# Altium schematic sheet mipi_deserializer.SchDoc (part 2 of 2)
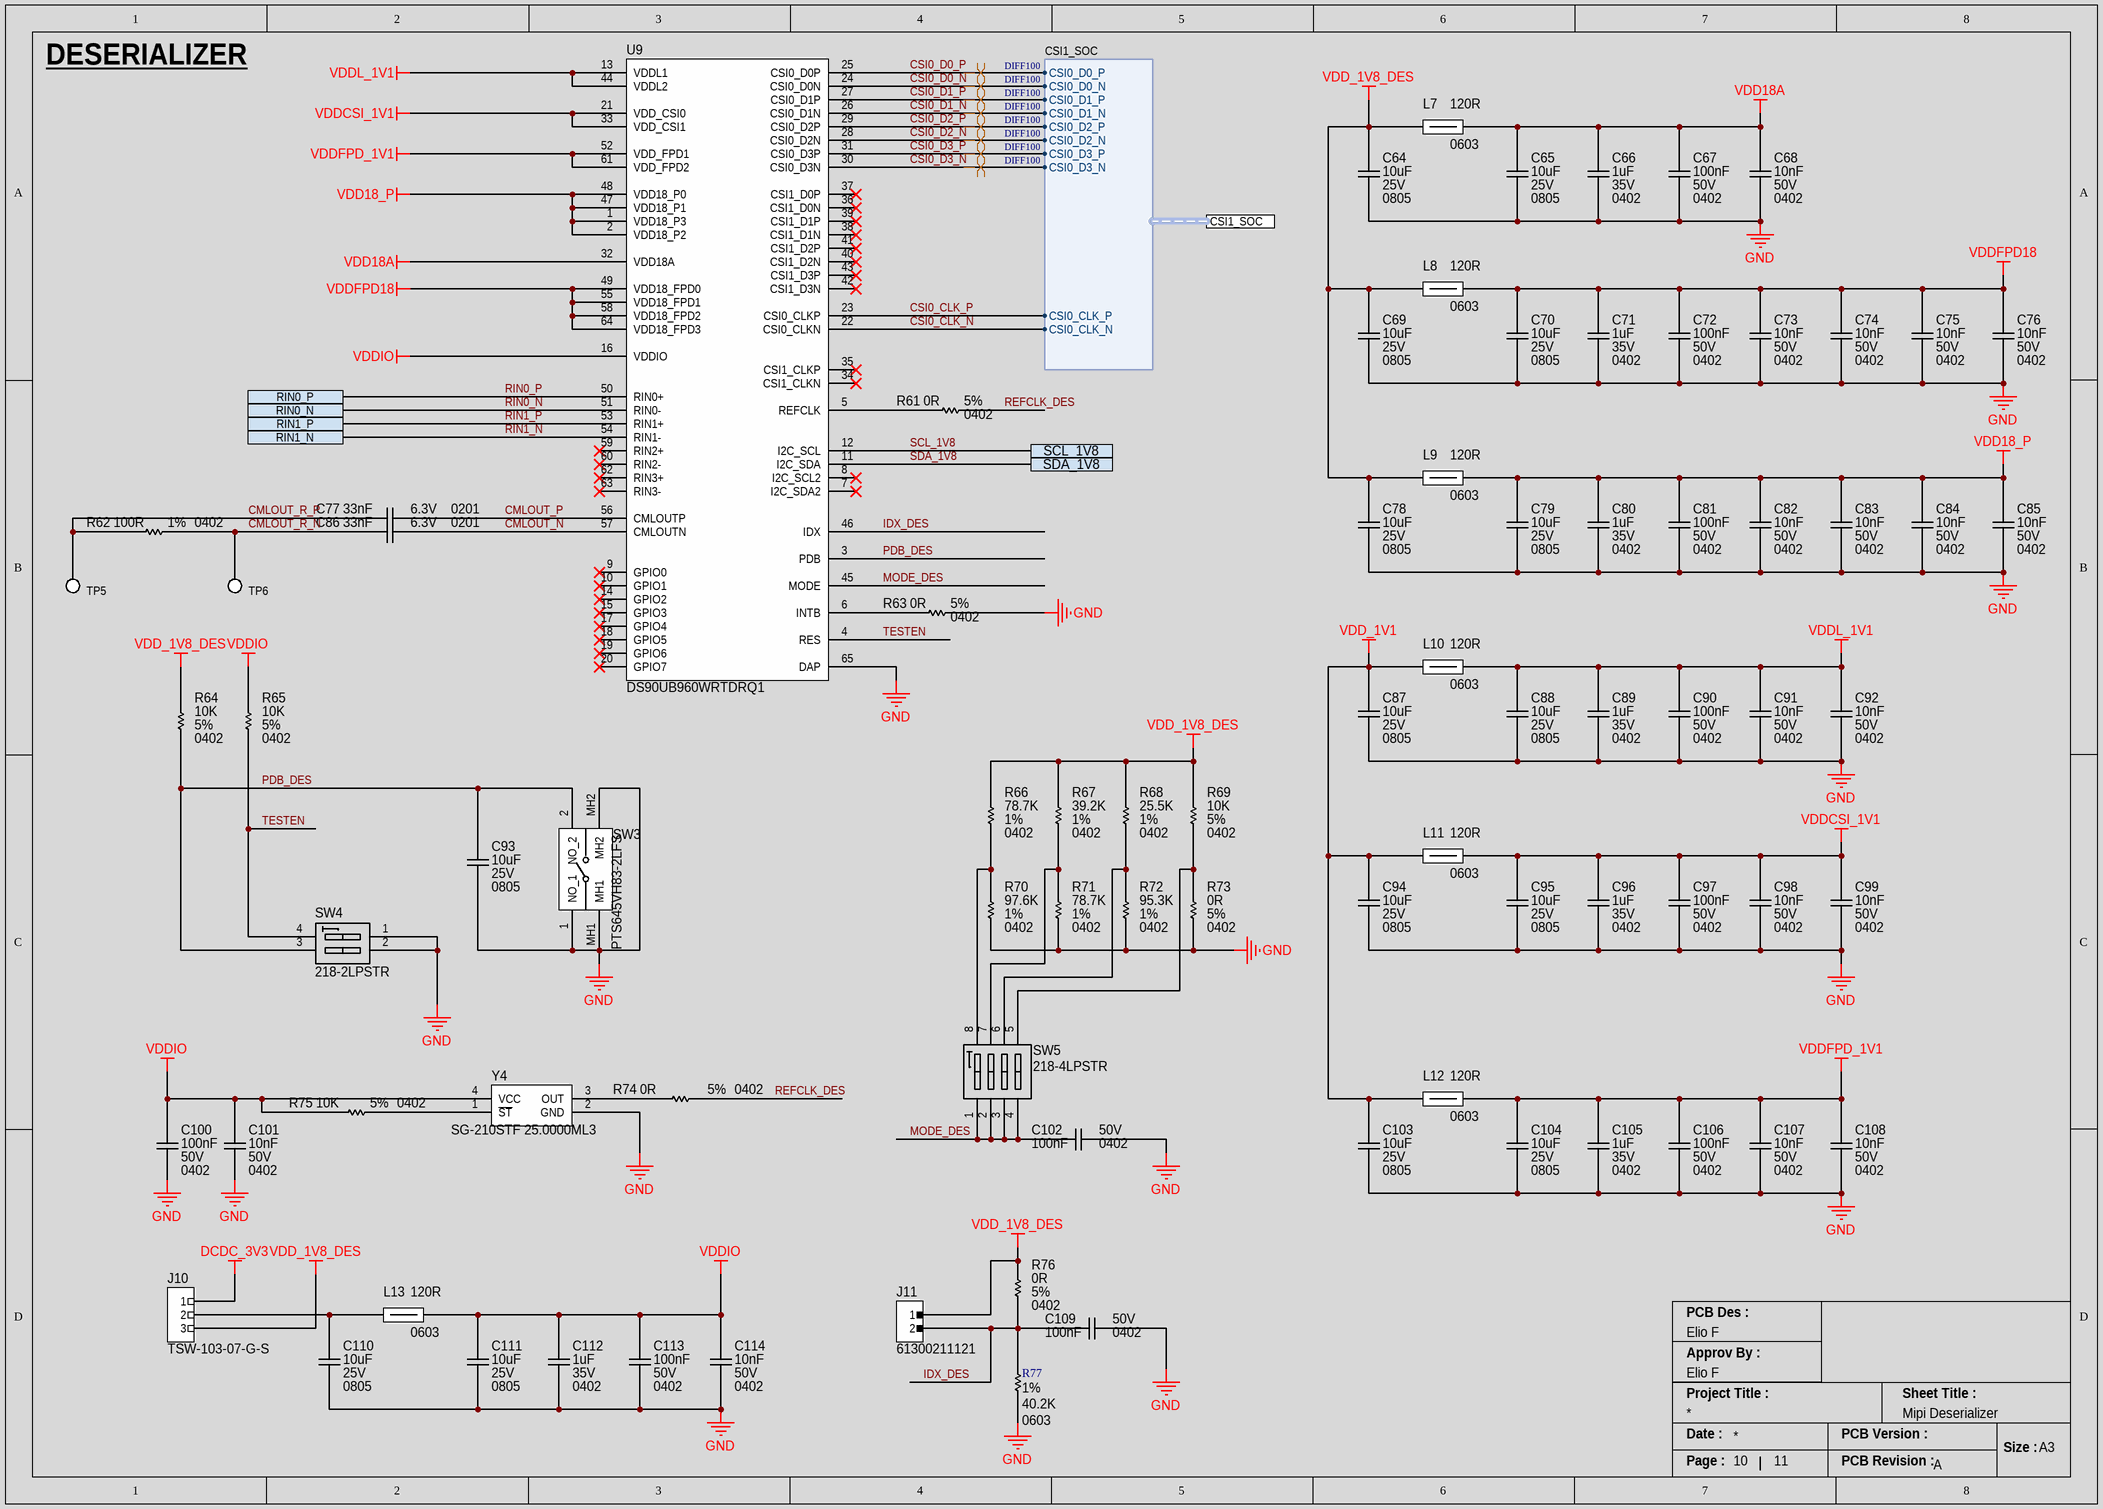
[diagram p1: mipi_deserializer.SchDoc]

## Library data of the parts
C64 C65 C69 C70 C78 C79 C87 C88 C93-C95 C103 C104 C110 C111 = CAP_10UF_25V_X5R_0805: CAP CER 10UF 25V X5R 0805; Manufacturer: Samsung; Tolerance: 10%; Manufacturer Part Number: CL21A106KAYNNNE; RoHS: Yes; Category: Ceramic Capacitors; Stock 1: 1531231; Pricing 1: 1=0.18000, 10=0.12800, 50=0.07280, 100=0.06030, 500=0.04230, 1000=0.03501 (USD); Mount: Surface Mount; Case Code (Metric): 2012; Case Code (Imperial): 0805; Min Operating Temperature: -55°C; Max Operating Temperature: 85°C; Package Quantity: 1; Packaging: Tape and Reel; Dielectric: X5R; Series: CL; Construction: Flat; Length: 2mm; Width: 0.049inch; Height: 1.25mm; Depth: 1.25mm; Thickness: 0.057inch; Radiation Hardening: No; RoHS Compliant: Yes; ComponentLink1URL: https://datasheet.ciiva.com/25796/cl21a106kaynnne-25796720.pdf?src-supplier=Digi-Key; ComponentLink1Description: https://datasheet.ciiva.com/25796/cl21a106kaynnne-25796720.pdf?src-supplier=Digi-Key; ComponentLink2URL: https://datasheet.ciiva.com/26838/getdatasheetpartid-357558-26838583.pdf?src-supplier=Verical; ComponentLink2Description: https://datasheet.ciiva.com/26838/getdatasheetpartid-357558-26838583.pdf?src-supplier=Verical; Supplier 1: Digi-Key; Supplier 2: Newark; Supplier 3: Mouser; Supplier Part Number 1: 1276-2891-6-ND; Supplier Part Number 2: 82AC9388; Supplier Part Number 3: 187-CL21A106KAYNNNE
C66 C71 C80 C89 C96 C105 C112 = CAP_1uF_35V_JB_0402: Cap Ceramic 1uF 35V JB 10% SMD 0402 85°C Punched Paper T/R; Manufacturer: TDK; Material: 4241ConductorMaterial; Supplier 1: Digikey; Manufacturer Part Number: C1005JB1V105K050BC; RoHS: Yes; Category: Ceramic Capacitors; Stock 1: 17379; Pricing 1: 1=0.17, 10=0.095, 50=0.0662, 100=0.0574, 500=0.04248, 1000=0.03785, 2500=0.03294, 5000=0.02996 (USD); Mount: Surface Mount; Case Code (Metric): 1005; Case Code (Imperial): 0402; Weight: 0.001199oz; Dielectric Material: Ceramic; Min Operating Temperature: -25°C; Max Operating Temperature: 85°C; Package Quantity: 10000; Packaging: Tape and Reel; Tolerance: 10%; Termination: SMD/SMT; Voltage Rating (DC): 35V; Series: C; Length: 0.039inch; Width: 0.02inch; Height: 550um; Thickness: 0.022inch; Lead Free: Lead Free; RoHS Compliant: Yes; ComponentLink1URL: https://datasheet.ciiva.com/14885/tdkmlcccaprange-14885800.pdf?src-supplier=Digikey; ComponentLink1Description: https://datasheet.ciiva.com/14885/tdkmlcccaprange-14885800.pdf?src-supplier=Digikey; ComponentLink2URL: https://datasheet.ciiva.com/14885/tdkmlcccaprange-14885801.pdf?src-supplier=Digikey; ComponentLink2Description: https://datasheet.ciiva.com/14885/tdkmlcccaprange-14885801.pdf?src-supplier=Digikey; ComponentLink3URL: https://datasheet.ciiva.com/14885/tdkmlcccaprange-14885802.pdf?src-supplier=Digikey; ComponentLink3Description: https://datasheet.ciiva.com/14885/tdkmlcccaprange-14885802.pdf?src-supplier=Digikey; Supplier Part Number 1: 445-11014-1-ND
C67 C72 C81 C90 C97 C100 C102 C106 C109 C113 = CAP_100NF_50V_X7R_0402: Multilayer Ceramic Capacitor, 0.1 uF, 16 V, ± 10%, X7R, 0402 [1005 Metric]; Manufacturer: Murata; Dissipation Factor: 0.025%; Temperature Coefficient: 30ppm/°C; Supplier 1: DigiKey; Manufacturer Part Number: GRM155R71H104KE14D; RoHS: Yes; Category: Ceramic Capacitors; Stock 1: 13730790; Pricing 1: 1=0.1, 10=0.023, 50=0.0132, 100=0.0102, 500=0.00768, 1000=0.00603, 2500=0.00548, 5000=0.00504 (USD); Mount: Surface Mount; Number of Pins: 2NUMBER; Case Code (Metric): 1005; Material: Ceramic; Case Code (Imperial): 0402; Weight: 0.000212oz; Dielectric Material: Ceramic; Min Operating Temperature: -55°C; Max Operating Temperature: 125°C; Packaging: Tape and Reel; Package Quantity: 10000; Series: GRM; Tolerance: 10%; Dielectric: X7R; Termination: SMD/SMT; Voltage: 50V; Voltage Rating (DC): 50V; Construction: Flat; Length: 1mm; Width: 0.5mm; Height: 0.5mm; Depth: 0.5mm; Thickness: 0.022inch; Reach SVHC Compliant: No; RoHS Compliant: Yes; Lead Free: 5697LeadFree; ComponentLink1URL: http://www.farnell.com/datasheets/2079156.pdf?src-supplier=Farnell; ComponentLink1Description: http://www.farnell.com/datasheets/2079156.pdf?src-supplier=Farnell; ComponentLink2URL: http://www.mouser.com/ds/2/281/c02e-2905.pdf?src-supplier=Mouser; ComponentLink2Description: http://www.mouser.com/ds/2/281/c02e-2905.pdf?src-supplier=Mouser; ComponentLink3URL: http://www.farnell.com/datasheets/2079156.pdf?src-supplier=Newark; ComponentLink3Description: http://www.farnell.com/datasheets/2079156.pdf?src-supplier=Newark; ComponentLink4URL: https://datasheet.octopart.com/GRM155R71H104KE14D-Murata-datasheet-22122223.pdf?src-supplier=Future+Electronics; ComponentLink4Description: https://datasheet.octopart.com/GRM155R71H104KE14D-Murata-datasheet-22122223.pdf?src-supplier=Future+Electronics; ComponentLink5URL: https://search.murata.co.jp/Ceramy/image/img/A01X/G101/ENG/GRM155R71H104KE14-01.pdf?src-supplier=Digi-Key; ComponentLink5Description: https://search.murata.co.jp/Ceramy/image/img/A01X/G101/ENG/GRM155R71H104KE14-01.pdf?src-supplier=Digi-Key; ComponentLink6URL: http://psearch.en.murata.com/capacitor/product/GRM155R71H104KE14%23.pdf?src-supplier=Avnet; ComponentLink6Description: http://psearch.en.murata.com/capacitor/product/GRM155R71H104KE14%23.pdf?src-supplier=Avnet; ComponentLink7URL: https://datasheet.octopart.com/GRM155R71H104KE14D-Murata-datasheet-66077078.pdf?src-supplier=Element14; ComponentLink7Description: https://datasheet.octopart.com/GRM155R71H104KE14D-Murata-datasheet-66077078.pdf?src-supplier=Element14; Supplier Part Number 1: 490-10700-6-ND; Supplier 2: Digikey; Stock 2: 3706055; Pricing 2: 1=0.1, 10=0.037, 50=0.021, 100=0.0162, 500=0.01224, 1000=0.00961, 2500=0.00874, 5000=0.00804 (USD); Halogen Free: 5694HalogenFree; ComponentLink8URL: http://www.mouser.com/ds/2/447/UPY-GPHC_X5R_4V-to-50V_25-1131599.pdf?src-supplier=Mouser; ComponentLink8Description: http://www.mouser.com/ds/2/447/UPY-GPHC_X5R_4V-to-50V_25-1131599.pdf?src-supplier=Mouser; ComponentLink9URL: https://datasheet.octopart.com/CC0402KRX5R8BB104-Yageo-datasheet-137700082.pdf?src-supplier=Future+Electronics; ComponentLink9Description: https://datasheet.octopart.com/CC0402KRX5R8BB104-Yageo-datasheet-137700082.pdf?src-supplier=Future+Electronics; ComponentLink10URL: http://www.yageo.com/documents/recent/UPY-GPHC_X5R_4V-to-50V_25.pdf?src-supplier=Digikey; ComponentLink10Description: http://www.yageo.com/documents/recent/UPY-GPHC_X5R_4V-to-50V_25.pdf?src-supplier=Digikey; ComponentLink11URL: https://datasheet.octopart.com/CC0402KRX5R8BB104-Yageo-datasheet-140260304.pdf?src-supplier=Newark; ComponentLink11Description: https://datasheet.octopart.com/CC0402KRX5R8BB104-Yageo-datasheet-140260304.pdf?src-supplier=Newark; ComponentLink12URL: https://datasheet.octopart.com/CC0402KRX5R8BB104-Yageo-datasheet-170350636.pdf?src-supplier=Future+Electronics; ComponentLink12Description: https://datasheet.octopart.com/CC0402KRX5R8BB104-Yageo-datasheet-170350636.pdf?src-supplier=Future+Electronics; ComponentLink13URL: http://www.yageo.com/documents/recent/UPY-GPHC_X5R_4V-to-50V-16.pdf?src-supplier=Future+Electronics; ComponentLink13Description: http://www.yageo.com/documents/recent/UPY-GPHC_X5R_4V-to-50V-16.pdf?src-supplier=Future+Electronics; Supplier Part Number 2: 311-1697-1-ND
C68 C73-C76 C82-C85 C91 C92 C98 C99 C101 C107 C108 C114 = CAP_10nF_50V_X7R_0402: Multilayer Ceramic Capacitors MLCC Surface Mount 0402 0.01uF 50 Volts X7R 10%; Manufacturer: Murata; Voltage: 25V; Supplier 1: Digikey; Manufacturer Part Number: GRM155R71H103KA88D; RoHS: Yes; Category: Ceramic Capacitors; Stock 1: 5190059; Pricing 1: 1=0.1, 10=0.023, 50=0.013, 100=0.0101, 500=0.0076, 1000=0.00598, 2500=0.00543, 5000=0.005 (USD); Mount: Surface Mount; Number of Pins: 2; Case Code (Metric): 1005; Case Code (Imperial): 0402; Material: Ceramic; Min Operating Temperature: -55°C; Max Operating Temperature: 125°C; Tolerance: 10%; Packaging: Tape and Reel; Package Quantity: 1; Dielectric: X7R; Termination: SMD/SMT; Series: GRM; Construction: Flat; Voltage Rating (DC): 50V; Length: 1mm; Width: 0.02inch; Height: 0.5mm; Thickness: 0.022inch; Depth: 0.5mm; Radiation Hardening: No; Reach SVHC Compliant: No; RoHS Compliant: Yes; Lead Free: 5697LeadFree; ComponentLink1URL: https://datasheet.ciiva.com/22698/1747449-22698420.pdf?src-supplier=Element14; ComponentLink1Description: https://datasheet.ciiva.com/22698/1747449-22698420.pdf?src-supplier=Element14; ComponentLink2URL: https://datasheet.ciiva.com/19476/1856433-19476546.pdf?src-supplier=Jameco; ComponentLink2Description: https://datasheet.ciiva.com/19476/1856433-19476546.pdf?src-supplier=Jameco; ComponentLink3URL: https://datasheet.ciiva.com/129/product-129810.pdf?src-supplier=Digikey; ComponentLink3Description: https://datasheet.ciiva.com/129/product-129810.pdf?src-supplier=Digikey; ComponentLink4URL: https://datasheet.ciiva.com/11786/0900766b80ef921d-11786340.pdf?src-supplier=Rs; ComponentLink4Description: https://datasheet.ciiva.com/11786/0900766b80ef921d-11786340.pdf?src-supplier=Rs; ComponentLink5URL: https://datasheet.ciiva.com/18100/getdatasheetpartid-27434-18100660.pdf?src-supplier=Verical; ComponentLink5Description: https://datasheet.ciiva.com/18100/getdatasheetpartid-27434-18100660.pdf?src-supplier=Verical; ComponentLink6URL: https://datasheet.ciiva.com/29199/454225-da-01-en-vs-kondensator-0402-29199740.pdf?src-supplier=Conrad; ComponentLink6Description: https://datasheet.ciiva.com/29199/454225-da-01-en-vs-kondensator-0402-29199740.pdf?src-supplier=Conrad; ComponentLink7URL: https://datasheet.ciiva.com/129/grm155r71h103ka88-01-129811.pdf?src-supplier=Digikey; ComponentLink7Description: https://datasheet.ciiva.com/129/grm155r71h103ka88-01-129811.pdf?src-supplier=Digikey; ComponentLink8URL: https://datasheet.ciiva.com/129/grm155r71h103ka88-01-129812.pdf?src-supplier=Digikey; ComponentLink8Description: https://datasheet.ciiva.com/129/grm155r71h103ka88-01-129812.pdf?src-supplier=Digikey; ComponentLink9URL: https://datasheet.ciiva.com/5410/product-5410990.pdf?src-supplier=Mouser; ComponentLink9Description: https://datasheet.ciiva.com/5410/product-5410990.pdf?src-supplier=Mouser; ComponentLink10URL: https://datasheet.ciiva.com/16495/product-16495290.pdf?src-supplier=Future+Electronics; ComponentLink10Description: https://datasheet.ciiva.com/16495/product-16495290.pdf?src-supplier=Future+Electronics; Supplier Part Number 1: 490-4516-6-ND
C77 C86 = CAP_0.033uF_6.3V_X5R_0201: Multilayer Ceramic Capacitor, 0.033 uF, 6.3 V, ± 10%, X5R, 0201 [0603 Metric]; Manufacturer: Murata; Dissipation Factor: 0.1%; Supplier 1: Mouser; Manufacturer Part Number: GRM033R60J333KE01D; RoHS: Yes; Category: Ceramic Capacitors; Stock 1: 164761; Pricing 1: 1=0.1, 10=0.017, 50=0.017, 100=0.011, 1000=0.01, 10000=0.008 (USD); Mount: Surface Mount; Case Code (Metric): 0603; Case Code (Imperial): 0201; Material: Ceramic; Min Operating Temperature: -55°C; Max Operating Temperature: 85°C; Tolerance: 10%; Packaging: Tape and Reel; Voltage Rating (DC): 6.3V; Package Quantity: 1; Dielectric: X5R; Termination: SMD/SMT; Voltage: 6.3V; Series: GRM; Construction: Flat; Length: 0.6mm; Width: 0.012inch; Height: 0.3mm; Thickness: 0.013inch; Depth: 0.3mm; Radiation Hardening: No; Reach SVHC Compliant: No; Lead Free: Lead Free; RoHS Compliant: Yes; ComponentLink1URL: https://datasheet.ciiva.com/131/product-131104.pdf?src-supplier=Digikey; ComponentLink1Description: https://datasheet.ciiva.com/131/product-131104.pdf?src-supplier=Digikey; ComponentLink2URL: https://datasheet.ciiva.com/18184/getdatasheetpartid-220776-18184045.pdf?src-supplier=Verical; ComponentLink2Description: https://datasheet.ciiva.com/18184/getdatasheetpartid-220776-18184045.pdf?src-supplier=Verical; ComponentLink3URL: https://datasheet.ciiva.com/29199/455665-da-01-en-vs-kondensator-0201-29199269.pdf?src-supplier=Conrad; ComponentLink3Description: https://datasheet.ciiva.com/29199/455665-da-01-en-vs-kondensator-0201-29199269.pdf?src-supplier=Conrad; ComponentLink4URL: https://datasheet.ciiva.com/11605/product-11605453.pdf?src-supplier=Avnet; ComponentLink4Description: https://datasheet.ciiva.com/11605/product-11605453.pdf?src-supplier=Avnet; ComponentLink5URL: https://datasheet.ciiva.com/16199/product-16199350.pdf?src-supplier=Future+Electronics; ComponentLink5Description: https://datasheet.ciiva.com/16199/product-16199350.pdf?src-supplier=Future+Electronics; Supplier Part Number 1: 81-GRM033R60J333KE01
J10 = CONN_HEADER_MALE_3P_2.54mm_TSW-103-07-G-S: Conn Unshrouded Header HDR 3 POS 2.54mm Solder ST Top Entry Thru-Hole Bulk; Manufacturer: Samtec; Number of Contacts: 3; Gender: Male; Max Current Rating: 7.6A; Max Voltage Rating (AC): 550V; Supplier 1: Digikey; Manufacturer Part Number: TSW-103-07-G-S; RoHS: Yes; Category: Board to Board Connectors; Stock 1: 5646; Pricing 1: 1=0.61, 10=0.494, 100=0.403, 500=0.3493, 1000=0.32848, 5000=0.28482, 10000=0.2735 (USD); Mount: Through Hole; Contact Plating: Gold; Contact Material: Bronze; Housing Color: Black; Housing Material: Polyester; Color: Black; Min Operating Temperature: -55°C; Max Operating Temperature: 125°C; Number of Rows: 1; Packaging: Bulk; Termination: Solder; Number of Positions: 3; Series: TSW; Contact Type: Male Pin; Orientation: Vertical; Package Quantity: 1; Length: 7.62mm; Pitch: 2.54mm; Depth: 2.54mm; Contact Mating Length: 0.23inch; RoHS Compliant: Yes; Lead Free: Lead Free; Reach SVHC Compliant: No; ComponentLink1URL: https://datasheet.ciiva.com/6889/tsw-xxx-xx-xxx-x-xx-xxx-mkt-6889655.pdf?src-supplier=Digikey; ComponentLink1Description: https://datasheet.ciiva.com/6889/tsw-xxx-xx-xxx-x-xx-xxx-mkt-6889655.pdf?src-supplier=Digikey; ComponentLink2URL: https://datasheet.ciiva.com/7124/tsw-th-7124622.pdf?src-supplier=Newark; ComponentLink2Description: https://datasheet.ciiva.com/7124/tsw-th-7124622.pdf?src-supplier=Newark; Supplier Part Number 1: SAM1029-03-ND
J11 = CONN_HEADER_MALE_2P_2.54_61300211121: THT Vertical Pin Header WR-PHD, Pitch 2.54 mm, Single Row, 2 pins; Manufacturer: Wurth Electronics; Current Rating: 3A; Voltage Rating: 250V; Number of Positions: 2; Gender: 29Gender; Contact Resistance: 20mR; Pitch: 0.1inch; Supplier 1: Digikey; Manufacturer Part Number: 61300211121; RoHS: Yes; Category: Headers and Wire Housings; Stock 1: 91042; Pricing 1: 1=0.13, 10=0.113, 25=0.094, 50=0.079, 100=0.071, 1000=0.065 (USD); Mount: Through Hole; Contact Plating: Gold; Housing Material: PBT; Contact Material: Copper Alloy,Copper; Color: Black; Min Operating Temperature: -40°C; Max Operating Temperature: 125°C; Number of Rows: 1; Contact Gender: Male; Packaging: Bulk; Termination: Through Hole; Number of Contacts: 2; Series: WR-PHD; Contact Type: Male Pin; Operating Supply Voltage: 250V; Orientation: Vertical; Height: 8.94mm; Contact Mating Length: 0.236inch; Lead Free: Lead Free; RoHS Compliant: Yes; Reach SVHC Compliant: Unknown; ComponentLink1URL: https://datasheet.ciiva.com/13619/6130xx11121-48870-13619345.pdf?src-supplier=Mouser; ComponentLink1Description: https://datasheet.ciiva.com/13619/6130xx11121-48870-13619345.pdf?src-supplier=Mouser; Supplier Part Number 1: 732-5315-ND
L7-L13 = IND_FERRITE_BEADS_120R_2A_0603_BLM18PG121SH1D: Ferrite Beads Multi-Layer 120Ohm 25% 100MHz 2A 50mOhm DCR 0603 Automotive Paper T/R; Manufacturer: Murata; Number of Lines: 1; Shielding: Unshielded; DC Resistance-Max: 50mR; Supplier 1: Digi-Key; Manufacturer Part Number: BLM18PG121SH1D; RoHS: Yes; Category: Ferrite Beads and Chips; Stock 1: 282143; Pricing 1: 1=0.11, 10=0.086, 25=0.0772, 50=0.0566, 100=0.0489, 250=0.03864, 500=0.03262, 1000=0.02747 (USD); Mount: Surface Mount; Case Code (Metric): 1608; Case Code (Imperial): 0603; Weight: 7.1E-05oz; Contact Plating: Tin,Matte; Material: Ferrite; Min Operating Temperature: -55°C; Max Operating Temperature: 125°C; Tolerance: 25%; Packaging: Tape and Reel; Package Quantity: 1; Current Rating: 2A; Max Current Rating: 2A; Termination: SMD/SMT; Max DC Current: 2A; Test Frequency: 100MHz; Number of Circuits: 1; Series: EMIFIL®, BLM18P; Length: 1.6mm; Width: 0.031inch; Height: 0.8mm; Depth: 0.8mm; Ratings: AEC-Q200; Lead Free: Lead Free; RoHS Compliant: Yes; ComponentLink1URL: https://datasheet.octopart.com/BLM18PG121SH1D-Murata-datasheet-141273661.pdf?src-supplier=Element14; ComponentLink1Description: https://datasheet.octopart.com/BLM18PG121SH1D-Murata-datasheet-141273661.pdf?src-supplier=Element14; ComponentLink2URL: https://datasheet.octopart.com/BLM18PG121SH1D-Murata-datasheet-62086335.pdf?src-supplier=Future+Electronics; ComponentLink2Description: https://datasheet.octopart.com/BLM18PG121SH1D-Murata-datasheet-62086335.pdf?src-supplier=Future+Electronics; ComponentLink3URL: http://search.murata.co.jp/Ceramy/image/img/PDF/ENG/L0132S0193BLM18P.pdf?src-supplier=Avnet; ComponentLink3Description: http://search.murata.co.jp/Ceramy/image/img/PDF/ENG/L0132S0193BLM18P.pdf?src-supplier=Avnet; ComponentLink4URL: https://www.murata.com/en-us/products/productdata/8796738650142/ENFA0003.pdf?src-supplier=Digi-Key; ComponentLink4Description: https://www.murata.com/en-us/products/productdata/8796738650142/ENFA0003.pdf?src-supplier=Digi-Key; Supplier Part Number 1: 490-7815-6-ND
R61 R63 R73 R74 R76 = RES_0R_5%_100mW_0402: SMD Chip Resistor, Jumper, 0 ohm, 100 mW, 0402 [1005 Metric], Thick Film, General Purpose; Manufacturer: Panasonic; Power Rating: 100mW; Voltage Rating: 50V; Temperature Coefficient: 600ppm/°C; Supplier 1: Mouser; Manufacturer Part Number: ERJ-2GE0R00X; RoHS: Yes; Category: Chip SMD Resistors; Stock 1: 10989354; Pricing 1: 1=0.1, 10=0.013, 50=0.013, 100=0.006, 1000=0.004, 2500=0.003, 10000=0.003 (USD); Mount: Surface Mount; Case/Package: 0402; Contact Plating: Tin; Case Code (Metric): 1005; Size Code: 0402; Min Operating Temperature: -55°C; Max Operating Temperature: 155°C; Resistor Type: Thick Film; Packaging: Cut Tape; Package Quantity: 10000; Number of Terminations: 2; Termination: SMD/SMT; Max Power Dissipation: 100mW; Voltage Rating (DC): 50V; Features: Automotive AEC-Q200; Series: ERJ; Construction: Rectangular; Technology: THICK FILM; Length: 1mm; Width: 0.5mm; Height: 0.35mm; Depth: 0.5mm; Ratings: AEC-Q200; Radiation Hardening: No; Reach SVHC Compliant: No; Military Standard: Not; Lead Free: Lead Free; RoHS Compliant: Yes; ComponentLink1URL: https://datasheet.ciiva.com/11821/0900766b80f806dd-11821176.pdf?src-supplier=Rs; ComponentLink1Description: https://datasheet.ciiva.com/11821/0900766b80f806dd-11821176.pdf?src-supplier=Rs; ComponentLink2URL: https://datasheet.ciiva.com/43460/1678796-43460347.pdf?src-supplier=Farnell; ComponentLink2Description: https://datasheet.ciiva.com/43460/1678796-43460347.pdf?src-supplier=Farnell; ComponentLink3URL: https://datasheet.ciiva.com/46389/1678796-46389518.pdf?src-supplier=Element14; ComponentLink3Description: https://datasheet.ciiva.com/46389/1678796-46389518.pdf?src-supplier=Element14; ComponentLink4URL: https://datasheet.ciiva.com/5959/1678796-5959692.pdf?src-supplier=Farnell; ComponentLink4Description: https://datasheet.ciiva.com/5959/1678796-5959692.pdf?src-supplier=Farnell; ComponentLink5URL: https://datasheet.ciiva.com/28695/1678796-28695758.pdf?src-supplier=Element14; ComponentLink5Description: https://datasheet.ciiva.com/28695/1678796-28695758.pdf?src-supplier=Element14; ComponentLink6URL: https://datasheet.ciiva.com/16783/70260739-16783734.pdf?src-supplier=Allied+Electronics; ComponentLink6Description: https://datasheet.ciiva.com/16783/70260739-16783734.pdf?src-supplier=Allied+Electronics; ComponentLink7URL: https://datasheet.ciiva.com/16778/70260739-16778335.pdf?src-supplier=Allied+Electronics; ComponentLink7Description: https://datasheet.ciiva.com/16778/70260739-16778335.pdf?src-supplier=Allied+Electronics; ComponentLink8URL: https://datasheet.ciiva.com/48531/aoa0000ce1-48531077.pdf?src-supplier=Avnet; ComponentLink8Description: https://datasheet.ciiva.com/48531/aoa0000ce1-48531077.pdf?src-supplier=Avnet; ComponentLink9URL: https://datasheet.ciiva.com/30097/4aoa0000ce1-30097116.pdf?src-supplier=Onlinecomponents.com; ComponentLink9Description: https://datasheet.ciiva.com/30097/4aoa0000ce1-30097116.pdf?src-supplier=Onlinecomponents.com; Supplier Part Number 1: 667-ERJ-2GE0R00X
R62 = RES_100R_1%_100mW_0402: Resistor Thick Film 0402 100 Ohm 1% 1/10W 100ppm/C Molded SMD Punched Carrier T/R; Manufacturer: Panasonic; Temperature Coefficient: 100ppm/°C; Power Rating: 100mW; Voltage Rating: 50V; Supplier 1: Mouser; Manufacturer Part Number: ERJ-2RKF1000X; RoHS: Yes; Category: Chip SMD Resistors; Stock 1: 10699571; Pricing 1: 1=0.1, 10=0.015, 50=0.015, 100=0.009, 1000=0.006, 10000=0.004 (USD); Mount: Surface Mount; Number of Pins: 2; Contact Plating: Tin; Case Code (Imperial): 0402; Case Code (Metric): 1005; Size Code: 0402; Min Operating Temperature: -55°C; Max Operating Temperature: 155°C; Resistor Type: Thick Film; Packaging: Tape and Reel; Package Quantity: 1; Termination: SMD/SMT; Number of Terminations: 2; Max Power Dissipation: 100mW; Voltage Rating (DC): 50V; Features: Automotive AEC-Q200; Series: ERJ; Technology: THICK FILM; Resistance Tolerance: 1%; Construction: Rectangular; Length: 1mm; Width: 0.5mm; Height: 0.35mm; Depth: 0.5mm; Radiation Hardening: No; Reach SVHC Compliant: No; Military Standard: Not; Lead Free: Lead Free; RoHS Compliant: Yes; ComponentLink1URL: https://datasheet.ciiva.com/27056/2007311-27056035.pdf?src-supplier=Jameco; ComponentLink1Description: https://datasheet.ciiva.com/27056/2007311-27056035.pdf?src-supplier=Jameco; ComponentLink2URL: https://datasheet.ciiva.com/11821/0900766b80f80784-11821173.pdf?src-supplier=Rs; ComponentLink2Description: https://datasheet.ciiva.com/11821/0900766b80f80784-11821173.pdf?src-supplier=Rs; ComponentLink3URL: https://datasheet.ciiva.com/7830/426256-7830973.pdf?src-supplier=Element14; ComponentLink3Description: https://datasheet.ciiva.com/7830/426256-7830973.pdf?src-supplier=Element14; ComponentLink4URL: https://datasheet.ciiva.com/43467/1678782-43467223.pdf?src-supplier=Farnell; ComponentLink4Description: https://datasheet.ciiva.com/43467/1678782-43467223.pdf?src-supplier=Farnell; ComponentLink5URL: https://datasheet.ciiva.com/28514/1678782-28514175.pdf?src-supplier=Element14; ComponentLink5Description: https://datasheet.ciiva.com/28514/1678782-28514175.pdf?src-supplier=Element14; ComponentLink6URL: https://datasheet.ciiva.com/46372/1678782-46372741.pdf?src-supplier=Element14; ComponentLink6Description: https://datasheet.ciiva.com/46372/1678782-46372741.pdf?src-supplier=Element14; ComponentLink7URL: https://datasheet.ciiva.com/16776/70260748-16776427.pdf?src-supplier=Allied+Electronics; ComponentLink7Description: https://datasheet.ciiva.com/16776/70260748-16776427.pdf?src-supplier=Allied+Electronics; ComponentLink8URL: https://datasheet.ciiva.com/9186/aoa0000ce2-9186683.pdf?src-supplier=Avnet; ComponentLink8Description: https://datasheet.ciiva.com/9186/aoa0000ce2-9186683.pdf?src-supplier=Avnet; ComponentLink9URL: https://datasheet.ciiva.com/16199/aoa0000ce2-16199575.pdf?src-supplier=Future+Electronics; ComponentLink9Description: https://datasheet.ciiva.com/16199/aoa0000ce2-16199575.pdf?src-supplier=Future+Electronics; ComponentLink10URL: https://datasheet.ciiva.com/48531/aoa0000ce2-48531067.pdf?src-supplier=Avnet; ComponentLink10Description: https://datasheet.ciiva.com/48531/aoa0000ce2-48531067.pdf?src-supplier=Avnet; ComponentLink11URL: https://datasheet.ciiva.com/30260/aoa0000ce2-30260809.pdf?src-supplier=Onlinecomponents.com; ComponentLink11Description: https://datasheet.ciiva.com/30260/aoa0000ce2-30260809.pdf?src-supplier=Onlinecomponents.com; Supplier Part Number 1: 667-ERJ-2RKF1000X
R64 R65 R69 R75 = RES_10K_5%_100mW_0402: Res Thick Film 0402 10K Ohm 5% 1/10W ±200ppm/°C Molded SMD Punched Carrier T/R; Manufacturer: Panasonic; Power Rating: 100mW; Voltage Rating: 50V; Supplier 1: Digi-Key; Manufacturer Part Number: ERJ-2GEJ103X; RoHS: Yes; Category: Chip SMD Resistors; Stock 1: 4696986; Pricing 1: 1=0.1, 10=0.021, 50=0.0132, 100=0.011, 500=0.00744, 1000=0.00639, 5000=0.00464 (USD); Mount: Surface Mount; Contact Plating: Tin; Case Code (Metric): 1005; Case Code (Imperial): 0402; Size Code: 0402; Min Operating Temperature: -55°C; Max Operating Temperature: 155°C; Temperature Coefficient: 200ppm/°C; Packaging: Cut Tape; Resistor Type: Thick Film; Package Quantity: 10000; Number of Terminations: 2; Termination: SMD/SMT; Max Power Dissipation: 100mW; Features: Automotive AEC-Q200; Series: ERJ; Resistance Tolerance: 5%; Technology: THICK FILM; Voltage Rating (DC): 50V; Length: 1mm; Width: 0.5mm; Height: 0.35mm; Depth: 0.5mm; Ratings: AEC-Q200; Radiation Hardening: No; Reach SVHC Compliant: No; RoHS Compliant: Yes; Lead Free: 5697LeadFree; ComponentLink1URL: https://datasheet.ciiva.com/27055/1935721-27055112.pdf?src-supplier=Jameco; ComponentLink1Description: https://datasheet.ciiva.com/27055/1935721-27055112.pdf?src-supplier=Jameco; ComponentLink2URL: https://datasheet.ciiva.com/11821/0900766b80f806dd-11821170.pdf?src-supplier=Rs; ComponentLink2Description: https://datasheet.ciiva.com/11821/0900766b80f806dd-11821170.pdf?src-supplier=Rs; ComponentLink3URL: https://datasheet.ciiva.com/43460/1678796-43460391.pdf?src-supplier=Farnell; ComponentLink3Description: https://datasheet.ciiva.com/43460/1678796-43460391.pdf?src-supplier=Farnell; ComponentLink4URL: https://datasheet.ciiva.com/22785/1678796-22785949.pdf?src-supplier=Farnell; ComponentLink4Description: https://datasheet.ciiva.com/22785/1678796-22785949.pdf?src-supplier=Farnell; ComponentLink5URL: https://datasheet.ciiva.com/46371/1678796-46371910.pdf?src-supplier=Element14; ComponentLink5Description: https://datasheet.ciiva.com/46371/1678796-46371910.pdf?src-supplier=Element14; ComponentLink6URL: https://datasheet.ciiva.com/28514/1678796-28514154.pdf?src-supplier=Element14; ComponentLink6Description: https://datasheet.ciiva.com/28514/1678796-28514154.pdf?src-supplier=Element14; ComponentLink7URL: https://datasheet.ciiva.com/24070/aoa0000ce1-37422-24070679.pdf?src-supplier=Mouser; ComponentLink7Description: https://datasheet.ciiva.com/24070/aoa0000ce1-37422-24070679.pdf?src-supplier=Mouser; ComponentLink8URL: https://datasheet.ciiva.com/16767/70260739-16767130.pdf?src-supplier=Allied+Electronics; ComponentLink8Description: https://datasheet.ciiva.com/16767/70260739-16767130.pdf?src-supplier=Allied+Electronics; ComponentLink9URL: https://datasheet.ciiva.com/16774/70260739-16774504.pdf?src-supplier=Allied+Electronics; ComponentLink9Description: https://datasheet.ciiva.com/16774/70260739-16774504.pdf?src-supplier=Allied+Electronics; ComponentLink10URL: https://datasheet.ciiva.com/9194/aoa0000ce1-9194140.pdf?src-supplier=Avnet; ComponentLink10Description: https://datasheet.ciiva.com/9194/aoa0000ce1-9194140.pdf?src-supplier=Avnet; Supplier Part Number 1: P10KJCT-ND
R66 R71 = RES_78.7K_1%_63mW_0402: Res Thick Film 0402 78.7K Ohm 1% 1/16W ±100ppm/°C Molded SMD Paper T/R; Manufacturer: Vishay; Power Rating: 63mW; Voltage Rating: 50V; Supplier 1: Mouser; Manufacturer Part Number: CRCW040278K7FKED; RoHS: Yes; Category: Chip SMD Resistors; Stock 1: 70320; Pricing 1: 1=0.1, 10=0.017, 50=0.017, 100=0.01, 1000=0.008, 10000=0.005 (USD); Case/Package: 0402; Number of Pins: 2; Weight: 2.3E-05oz; Case Code (Metric): 1005; Size Code: 0402; Min Operating Temperature: -55°C; Max Operating Temperature: 155°C; Tolerance: 1%; Package Quantity: 10000; Packaging: Tape and Reel; Number of Terminations: 2; Temperature Coefficient: 100ppm/°C; Max Power Dissipation: 63mW; Features: Automotive AEC-Q200; Series: CRCW; Resistor Type: Thick Film; Termination: SMD/SMT; Voltage Rating (DC): 50V; Construction: Rectangular; Technology: THICK FILM; Length: 1mm; Width: 0.5mm; Height: 0.35mm; Depth: 0.5mm; Ratings: AEC-Q200; Lead Free: Lead Free; RoHS Compliant: Yes; Military Standard: Not; Reach SVHC Compliant: Unknown; ComponentLink1URL: https://datasheet.ciiva.com/2495/dcrcwe3-2495263.pdf?src-supplier=Digikey; ComponentLink1Description: https://datasheet.ciiva.com/2495/dcrcwe3-2495263.pdf?src-supplier=Digikey; ComponentLink2URL: https://datasheet.ciiva.com/2495/dcrcwe3-2495264.pdf?src-supplier=Digikey; ComponentLink2Description: https://datasheet.ciiva.com/2495/dcrcwe3-2495264.pdf?src-supplier=Digikey; ComponentLink3URL: https://datasheet.ciiva.com/2495/dcrcwe3-2495265.pdf?src-supplier=Digikey; ComponentLink3Description: https://datasheet.ciiva.com/2495/dcrcwe3-2495265.pdf?src-supplier=Digikey; ComponentLink4URL: https://datasheet.ciiva.com/5550/dcrcwe3-109170-5550798.pdf?src-supplier=Mouser; ComponentLink4Description: https://datasheet.ciiva.com/5550/dcrcwe3-109170-5550798.pdf?src-supplier=Mouser; ComponentLink5URL: https://datasheet.ciiva.com/22708/1697337-22708055.pdf?src-supplier=Element14; ComponentLink5Description: https://datasheet.ciiva.com/22708/1697337-22708055.pdf?src-supplier=Element14; ComponentLink6URL: https://datasheet.ciiva.com/16779/70201119-16779943.pdf?src-supplier=Allied+Electronics; ComponentLink6Description: https://datasheet.ciiva.com/16779/70201119-16779943.pdf?src-supplier=Allied+Electronics; ComponentLink7URL: https://datasheet.ciiva.com/16494/dcrcwe3-16494454.pdf?src-supplier=Future+Electronics; ComponentLink7Description: https://datasheet.ciiva.com/16494/dcrcwe3-16494454.pdf?src-supplier=Future+Electronics; Supplier Part Number 1: 71-CRCW0402-78.7K-E3
R67 = RES_39.2K_1%_63mW_0402: Res Thick Film 0402 39.2K Ohm 1% 1/16W ±100ppm/°C Molded SMD SMD Paper T/R; Manufacturer: Vishay; Power Rating: 63mW; Voltage Rating: 50V; Supplier 1: Newark; Manufacturer Part Number: CRCW040239K2FKED; RoHS: Yes; Category: Chip SMD Resistors; Stock 1: 6480; Pricing 1: 1=0.005, 25=0.005, 100=0.005, 250=0.005, 500=0.005, 1000=0.005 (USD); Case/Package: 0402; Number of Pins: 2; Weight: 2.3E-05oz; Case Code (Metric): 1005; Contact Plating: Tin; Size Code: 0402; Min Operating Temperature: -55°C; Max Operating Temperature: 155°C; Packaging: Tape and Reel; Package Quantity: 10; Termination: SMD/SMT; Number of Terminations: 2; Temperature Coefficient: 100ppm/°C; Max Power Dissipation: 63mW; Features: Automotive AEC-Q200; Series: CRCW; Resistor Type: Thick Film; Voltage Rating (DC): 50V; Construction: Rectangular; Resistance Tolerance: 1%; Technology: THICK FILM; Length: 1mm; Width: 0.02inch; Height: 0.35mm; Depth: 0.5mm; Radiation Hardening: No; RoHS Compliant: Yes; Lead Free: 5697LeadFree; Military Standard: Not; Reach SVHC Compliant: Unknown; ComponentLink1URL: https://datasheet.ciiva.com/11818/0900766b80d98824-11818068.pdf?src-supplier=Rs; ComponentLink1Description: https://datasheet.ciiva.com/11818/0900766b80d98824-11818068.pdf?src-supplier=Rs; ComponentLink2URL: https://datasheet.ciiva.com/2463/dcrcwe3-2463559.pdf?src-supplier=Digikey; ComponentLink2Description: https://datasheet.ciiva.com/2463/dcrcwe3-2463559.pdf?src-supplier=Digikey; ComponentLink3URL: https://datasheet.ciiva.com/2463/dcrcwe3-2463560.pdf?src-supplier=Digikey; ComponentLink3Description: https://datasheet.ciiva.com/2463/dcrcwe3-2463560.pdf?src-supplier=Digikey; ComponentLink4URL: https://datasheet.ciiva.com/2463/dcrcwe3-2463561.pdf?src-supplier=Digikey; ComponentLink4Description: https://datasheet.ciiva.com/2463/dcrcwe3-2463561.pdf?src-supplier=Digikey; ComponentLink5URL: https://datasheet.ciiva.com/7671/1697337-7671596.pdf?src-supplier=Element14; ComponentLink5Description: https://datasheet.ciiva.com/7671/1697337-7671596.pdf?src-supplier=Element14; ComponentLink6URL: https://datasheet.ciiva.com/7671/1533075-7671772.pdf?src-supplier=Element14; ComponentLink6Description: https://datasheet.ciiva.com/7671/1533075-7671772.pdf?src-supplier=Element14; ComponentLink7URL: https://datasheet.ciiva.com/3256/dcrcwe3-3256469.pdf?src-supplier=Avnet; ComponentLink7Description: https://datasheet.ciiva.com/3256/dcrcwe3-3256469.pdf?src-supplier=Avnet; ComponentLink8URL: https://datasheet.ciiva.com/22869/70201119-22869593.pdf?src-supplier=Allied+Electronics; ComponentLink8Description: https://datasheet.ciiva.com/22869/70201119-22869593.pdf?src-supplier=Allied+Electronics; ComponentLink9URL: https://datasheet.ciiva.com/16774/70201119-16774809.pdf?src-supplier=Allied+Electronics; ComponentLink9Description: https://datasheet.ciiva.com/16774/70201119-16774809.pdf?src-supplier=Allied+Electronics; ComponentLink10URL: https://datasheet.ciiva.com/16429/dcrcwe3-16429962.pdf?src-supplier=Future+Electronics; ComponentLink10Description: https://datasheet.ciiva.com/16429/dcrcwe3-16429962.pdf?src-supplier=Future+Electronics; Supplier Part Number 1: 52K7028
R68 = RES_25.5K_1%_63mW_0402: Res Thick Film 0402 25.5K Ohm 1% 1/16W ±100ppm/°C Molded SMD SMD Paper T/R; Manufacturer: Vishay; Power Rating: 63mW; Voltage Rating: 50V; Supplier 1: Newark; Manufacturer Part Number: CRCW040225K5FKED; RoHS: Yes; Category: Chip SMD Resistors; Stock 1: 9998; Pricing 1: 1=0.005, 25=0.005, 100=0.005, 250=0.005, 500=0.005, 1000=0.005 (USD); Case/Package: 0402; Number of Pins: 2; Weight: 2.3E-05oz; Case Code (Metric): 1005; Contact Plating: Tin; Size Code: 0402; Min Operating Temperature: -55°C; Max Operating Temperature: 155°C; Packaging: Tape and Reel; Package Quantity: 10; Number of Terminations: 2; Temperature Coefficient: 100ppm/°C; Max Power Dissipation: 63mW; Features: Automotive AEC-Q200; Series: CRCW; Resistor Type: Thick Film; Termination: SMD/SMT; Voltage Rating (DC): 50V; Resistance Tolerance: 1%; Technology: THICK FILM; Length: 1mm; Width: 0.02inch; Height: 0.35mm; Depth: 0.5mm; Radiation Hardening: No; RoHS Compliant: Yes; Lead Free: 5697LeadFree; Reach SVHC Compliant: Unknown; ComponentLink1URL: https://datasheet.ciiva.com/11818/0900766b80d98824-11818027.pdf?src-supplier=Rs; ComponentLink1Description: https://datasheet.ciiva.com/11818/0900766b80d98824-11818027.pdf?src-supplier=Rs; ComponentLink2URL: https://datasheet.ciiva.com/2463/dcrcwe3-2463772.pdf?src-supplier=Digikey; ComponentLink2Description: https://datasheet.ciiva.com/2463/dcrcwe3-2463772.pdf?src-supplier=Digikey; ComponentLink3URL: https://datasheet.ciiva.com/2463/dcrcwe3-2463773.pdf?src-supplier=Digikey; ComponentLink3Description: https://datasheet.ciiva.com/2463/dcrcwe3-2463773.pdf?src-supplier=Digikey; ComponentLink4URL: https://datasheet.ciiva.com/2463/dcrcwe3-2463774.pdf?src-supplier=Digikey; ComponentLink4Description: https://datasheet.ciiva.com/2463/dcrcwe3-2463774.pdf?src-supplier=Digikey; ComponentLink5URL: https://datasheet.ciiva.com/8336/dcrcwe3-8336701.pdf?src-supplier=Avnet; ComponentLink5Description: https://datasheet.ciiva.com/8336/dcrcwe3-8336701.pdf?src-supplier=Avnet; ComponentLink6URL: https://datasheet.ciiva.com/16389/dcrcwe3-16389982.pdf?src-supplier=Future+Electronics; ComponentLink6Description: https://datasheet.ciiva.com/16389/dcrcwe3-16389982.pdf?src-supplier=Future+Electronics; ComponentLink7URL: https://datasheet.ciiva.com/16761/70201119-16761375.pdf?src-supplier=Allied+Electronics; ComponentLink7Description: https://datasheet.ciiva.com/16761/70201119-16761375.pdf?src-supplier=Allied+Electronics; ComponentLink8URL: https://datasheet.ciiva.com/7671/1697337-7671565.pdf?src-supplier=Element14; ComponentLink8Description: https://datasheet.ciiva.com/7671/1697337-7671565.pdf?src-supplier=Element14; ComponentLink9URL: https://datasheet.ciiva.com/7671/1533075-7671768.pdf?src-supplier=Element14; ComponentLink9Description: https://datasheet.ciiva.com/7671/1533075-7671768.pdf?src-supplier=Element14; ComponentLink10URL: https://datasheet.ciiva.com/7172/1533075-7172954.pdf?src-supplier=Newark; ComponentLink10Description: https://datasheet.ciiva.com/7172/1533075-7172954.pdf?src-supplier=Newark; ComponentLink11URL: https://datasheet.ciiva.com/5547/dcrcwe3-109170-5547513.pdf?src-supplier=Mouser; ComponentLink11Description: https://datasheet.ciiva.com/5547/dcrcwe3-109170-5547513.pdf?src-supplier=Mouser; Supplier Part Number 1: 52K6888
R70 = RES_97.6K_1%_63mW_0402: CRCW Series 0402 97.6 kOhm 0.063 W ±1 % ±100 ppm/K SMT Thick Film Chip Resistor; Manufacturer: Vishay; Temperature Coefficient: 100ppm/°C; Max Power Dissipation: 63mW; Voltage Rating: 50V; Supplier 1: Digikey; Manufacturer Part Number: CRCW040297K6FKED; RoHS: Yes; Category: Chip SMD Resistors; Stock 1: 25927; Pricing 1: 1=0.1, 10=0.026, 50=0.0164, 100=0.0136, 500=0.00918, 1000=0.00789, 5000=0.00576, 10000=0.00512, 20000=0.00461, 30000=0.00435, 50000=0.00407, 70000=0.0039, 100000=0.00375, 250000=0.00341, 500000=0.00321, 1000000=0.00305 (USD); Number of Pins: 2; Weight: 2.3E-05oz; Case Code (Imperial): 0402; Case Code (Metric): 1005; Contact Plating: Tin; Min Operating Temperature: -55°C; Max Operating Temperature: 155°C; Packaging: Tape and Reel; Package Quantity: 10000; Features: Automotive AEC-Q200; Series: CRCW; Number of Terminations: 2; Power Rating: 63mW; Resistor Type: Thick Film; Voltage Rating (DC): 50V; Resistance Tolerance: 1%; Construction: Rectangular; Length: 1mm; Width: 0.5mm; Height: 0.35mm; Depth: 0.5mm; Ratings: AEC-Q200; Radiation Hardening: No; Lead Free: Lead Free; RoHS Compliant: Yes; Military Standard: Not; Reach SVHC Compliant: Unknown; ComponentLink1URL: https://datasheet.ciiva.com/3256/dcrcwe3-3256903.pdf?src-supplier=Avnet; ComponentLink1Description: https://datasheet.ciiva.com/3256/dcrcwe3-3256903.pdf?src-supplier=Avnet; ComponentLink2URL: https://datasheet.ciiva.com/7714/1697337-7714190.pdf?src-supplier=Element14; ComponentLink2Description: https://datasheet.ciiva.com/7714/1697337-7714190.pdf?src-supplier=Element14; ComponentLink3URL: https://datasheet.ciiva.com/7714/1697337-7714191.pdf?src-supplier=Element14; ComponentLink3Description: https://datasheet.ciiva.com/7714/1697337-7714191.pdf?src-supplier=Element14; ComponentLink4URL: https://datasheet.ciiva.com/7743/125364-7743782.pdf?src-supplier=Element14; ComponentLink4Description: https://datasheet.ciiva.com/7743/125364-7743782.pdf?src-supplier=Element14; ComponentLink5URL: https://datasheet.ciiva.com/22708/1697337-22708059.pdf?src-supplier=Element14; ComponentLink5Description: https://datasheet.ciiva.com/22708/1697337-22708059.pdf?src-supplier=Element14; ComponentLink6URL: https://datasheet.ciiva.com/5545/dcrcwe3-109170-5545381.pdf?src-supplier=Mouser; ComponentLink6Description: https://datasheet.ciiva.com/5545/dcrcwe3-109170-5545381.pdf?src-supplier=Mouser; Supplier Part Number 1: 541-97.6KLCT-ND
R72 = RES_95.3K_1%_63mW_0402: CRCW FIXED RESISTOR 0402 (1005Metric) Chip Resistor ±1% ±100ppm/C 95.3kOhm 0.063W 1/16W; Manufacturer: Vishay; Temperature Coefficient: 100ppm/°C; Max Power Dissipation: 63mW; Voltage Rating: 50V; Supplier 1: Digikey; Manufacturer Part Number: CRCW040295K3FKED; RoHS: Yes; Category: Chip SMD Resistors; Stock 1: 60308; Pricing 1: 1=0.1, 10=0.026, 50=0.0164, 100=0.0136, 500=0.00918, 1000=0.00789, 5000=0.00576, 10000=0.00512, 20000=0.00461, 30000=0.00435, 50000=0.00407, 70000=0.0039, 100000=0.00375, 250000=0.00341, 500000=0.00321, 1000000=0.00305 (USD); Case/Package: 0402; Number of Pins: 2; Weight: 2.3E-05oz; Case Code (Imperial): 0402; Case Code (Metric): 1005; Contact Plating: Tin; Min Operating Temperature: -55°C; Max Operating Temperature: 155°C; Packaging: Tape and Reel; Package Quantity: 10000; Features: Automotive AEC-Q200; Series: CRCW; Number of Terminations: 2; Power Rating: 63mW; Termination: SMD/SMT; Resistor Type: Thick Film; Voltage Rating (DC): 50V; Resistance Tolerance: 1%; Length: 1mm; Width: 0.5mm; Height: 0.35mm; Ratings: AEC-Q200; Radiation Hardening: No; Lead Free: Lead Free; RoHS Compliant: Yes; Reach SVHC Compliant: Unknown; ComponentLink1URL: https://datasheet.ciiva.com/22705/1697337-22705834.pdf?src-supplier=Element14; ComponentLink1Description: https://datasheet.ciiva.com/22705/1697337-22705834.pdf?src-supplier=Element14; ComponentLink2URL: https://datasheet.ciiva.com/5543/dcrcwe3-109170-5543177.pdf?src-supplier=Mouser; ComponentLink2Description: https://datasheet.ciiva.com/5543/dcrcwe3-109170-5543177.pdf?src-supplier=Mouser; Supplier Part Number 1: 541-95.3KLCT-ND
R77 = RES_40.2K_1%_100mW_0603: Res General Purpose Thick Film 0603 40.2K Ohm 1% 1/10W ±100ppm/°C Molded SMD Paper T/R; Manufacturer: Yageo; Power Rating: 100mW; Voltage Rating: 50V; Working Voltage: 75V; Manufacturer Part Number: RC0603FR-0740K2L; RoHS: Yes; Category: Chip SMD Resistors; Stock 1: 594637; Pricing 1: 1=0.10000, 10=0.01900, 100=0.00770, 1000=0.00345, 2500=0.00300 (USD); Mount: Surface Mount; Case Code (Imperial): 0603; Case Code (Metric): 1608; Min Operating Temperature: -55°C; Max Operating Temperature: 155°C; Packaging: Tape and Reel; Termination: SMD/SMT; Resistor Type: Thick Film; Temperature Coefficient: 100ppm/°C; Voltage Rating (DC): 50V; Number of Terminations: 2; Features: Moisture Resistant; Series: RC; Max Power Dissipation: 100mW; Construction: Rectangular; Technology: METAL OXIDE FILM; Length: 1.6mm; Width: 0.8mm; Height: 0.45mm; Depth: 0.8mm; Military Standard: Not; Lead Free: Lead Free; RoHS Compliant: Yes; ComponentLink1URL: https://datasheet.ciiva.com/12555/rc0603-272842-12555385.pdf?src-supplier=Mouser; ComponentLink1Description: https://datasheet.ciiva.com/12555/rc0603-272842-12555385.pdf?src-supplier=Mouser; Supplier 1: Digi-Key; Supplier 2: Newark; Supplier 3: Arrow Electronics; Supplier Part Number 1: 311-40.2KHRCT-ND; Supplier Part Number 2: 82AH8157; Supplier Part Number 3: RC0603FR-0740K2L
SW3 = SWITCH_SPST_NO_RA_PTS645VH83-2LFS: Switch Tactile N.O SPST Round Button PC Pins 0.05A 12VDC 100000Cycle 1.96N Thru-Hole Bulk; Manufacturer: ITT C&K; Mechanical Life: 100000Cycles; Actuator Material: Nylon,Polyamide,PA66; Max Voltage Rating (DC): 12V; Max Current Rating: 50mA; Illumination Type: Non-Illuminated; Switch Function: Off-Mom; Actuator Type: Standard; Supplier 1: Newark; Manufacturer Part Number: PTS645VH83-2LFS; RoHS: Yes; Stock 1: 103123; Pricing 1: 1=0.352 (USD); Mount: Through Hole; Contact Plating: Silver; Contact Material: Bronze; Color: Black; Min Operating Temperature: -20°C; Max Operating Temperature: 60°C; Packaging: Bulk; Operating Force: 1.96N; Throw Configuration: SPST; Termination: PC Pins; Voltage Rating (DC): 12V; Current Rating: 50mA; Package Quantity: 1000; Orientation: Right Angle; Series: PTS645; Length: 7.5mm; Depth: 12.3mm; Radiation Hardening: No; Lead Free: Lead Free; RoHS Compliant: Yes; ComponentLink1URL: https://datasheet.ciiva.com/26930/getdatasheetpartid-759839-26930136.pdf?src-supplier=Verical; ComponentLink1Description: https://datasheet.ciiva.com/26930/getdatasheetpartid-759839-26930136.pdf?src-supplier=Verical; ComponentLink2URL: https://datasheet.ciiva.com/14920/pts645-14920698.pdf?src-supplier=Digikey; ComponentLink2Description: https://datasheet.ciiva.com/14920/pts645-14920698.pdf?src-supplier=Digikey; Supplier Part Number 1: 41AJ9932
SW4 = SWITCH_DIP_2P_25mA_218-2LPSTR: Switch DIP ON OFF SPST 2 Recessed Slide 0.025A 24VDC Gull Wing 1000Cycles 1.27mm SMD T/R; Manufacturer: CTS; Voltage Rating (DC): 24V; Current Rating: 25mA; Number of Positions: 2; Actuator Type: Slide (Standard); Pitch: 0.05inch; Washable: Yes; Supplier 1: Digi-Key; Manufacturer Part Number: 218-2LPSTR; RoHS: Yes; Category: DIP Switches; Stock 1: 31125; Pricing 1: 1=0.97, 10=0.93, 25=0.8692, 100=0.7548, 250=0.6868, 500=0.6367, 1000=0.59021 (USD); Mount: Surface Mount; Contact Material: Copper; Contact Plating: Gold; Min Operating Temperature: -55°C; Max Operating Temperature: 85°C; Packaging: Tape and Reel; Throw Configuration: SPST; Termination: Gull Wing; Electrical Life: 1000Cycles; Series: 218; Package Quantity: 2000; Max Current Rating: 25mA; Orientation: Straight; Length: 0.146inch; Depth: 8.44mm; Radiation Hardening: No; Lead Free: Lead Free; RoHS Compliant: Yes; ComponentLink1URL: https://datasheet.ciiva.com/2865/218-2865152.pdf?src-supplier=Digi-Key; ComponentLink1Description: https://datasheet.ciiva.com/2865/218-2865152.pdf?src-supplier=Digi-Key; ComponentLink2URL: https://datasheet.ciiva.com/29890/218-29890939.pdf?src-supplier=Avnet; ComponentLink2Description: https://datasheet.ciiva.com/29890/218-29890939.pdf?src-supplier=Avnet; ComponentLink3URL: https://datasheet.ciiva.com/15184/getdatasheetpartid-224320-15184939.pdf?src-supplier=Verical; ComponentLink3Description: https://datasheet.ciiva.com/15184/getdatasheetpartid-224320-15184939.pdf?src-supplier=Verical; Supplier Part Number 1: CT3108CT-ND
SW5 = SWITCH_DIP_4P_25mA_218-4LPSTR: Switch DIP ON OFF SPST 4 Recessed Slide 0.025A 24VDC Gull Wing 1000Cycles 1.27mm SMD T/R; Manufacturer: CTS; Number of Positions: 4; Voltage Rating (DC): 24V; Actuator Type: Slide (Standard); Max Current Rating: 25mA; Washable: Yes; Supplier 1: Digi-Key; Manufacturer Part Number: 218-4LPSTR; RoHS: Yes; Category: DIP Switches; Stock 1: 12605; Pricing 1: 1=1.08, 10=1.041, 25=0.978, 100=0.8449, 250=0.76996, 500=0.71586, 1000=0.66592 (USD); Mount: Surface Mount; Contact Material: Copper; Contact Plating: Gold; Mechanical Life: 1000Cycles; Min Operating Temperature: -55°C; Max Operating Temperature: 85°C; Throw Configuration: SPST; Packaging: Tape and Reel; Electrical Life: 1000Cycles; Series: 218; Max Voltage Rating (DC): 24V; Termination: Gull Wing; Orientation: Straight; Package Quantity: 2000; Length: 6.25mm; Depth: 8.44mm; Radiation Hardening: No; Lead Free: Lead Free; RoHS Compliant: Yes; ComponentLink1URL: https://datasheet.ciiva.com/8676/218-8676896.pdf?src-supplier=Avnet; ComponentLink1Description: https://datasheet.ciiva.com/8676/218-8676896.pdf?src-supplier=Avnet; ComponentLink2URL: https://datasheet.ciiva.com/8082/218-8082342.pdf?src-supplier=Avnet; ComponentLink2Description: https://datasheet.ciiva.com/8082/218-8082342.pdf?src-supplier=Avnet; ComponentLink3URL: https://datasheet.ciiva.com/16303/218-16303941.pdf?src-supplier=Future+Electronics; ComponentLink3Description: https://datasheet.ciiva.com/16303/218-16303941.pdf?src-supplier=Future+Electronics; ComponentLink4URL: https://datasheet.ciiva.com/15184/getdatasheetpartid-141001-15184860.pdf?src-supplier=Verical; ComponentLink4Description: https://datasheet.ciiva.com/15184/getdatasheetpartid-141001-15184860.pdf?src-supplier=Verical; Supplier Part Number 1: CT3110CT-ND
TP5 TP6 = TP_PAD_SMD_Round: Test Point, SMD pad, round, 1.5mm, 1.6mm, 3mm diameter
U9 = IC_MIPI_DESEREALIZER_DS90UB960WRTDRQ1: Quad 2 MP camera hub FPD-Link III deserializer with dual CSI-2 output ports 64-VQFN -40 to 105; Manufacturer: Texas Instruments; Supplier 1: Texas Instruments; Manufacturer Part Number: DS90UB960WRTDRQ1; RoHS: Yes; Category: Integrated Circuits (ICs); Stock 1: 6702; Pricing 1: 1=18.26, 100=15.95, 250=12.298, 1000=11 (USD); Min Operating Temperature: -40°C; Max Operating Temperature: 105°C; RoHS Compliant: Yes; ComponentLink1URL: http://www.ti.com/general/docs/suppproductinfo.tsp?distId=10&amp;gotoUrl=http%3A%2F%2Fwww.ti.com%2Flit%2Fgpn%2Fds90ub960-q1&src-supplier=Digikey; ComponentLink1Description: http://www.ti.com/general/docs/suppproductinfo.tsp?distId=10&amp;gotoUrl=http%3A%2F%2Fwww.ti.com%2Flit%2Fgpn%2Fds90ub960-q1&src-supplier=Digikey; Supplier Part Number 1: DS90UB960WRTDRQ1
Y4 = CRYSTAL_OSC_25MHz_15pF_SG-210STF 25.0000ML3: Oscillator XO 25MHz ±50ppm 15pF CMOS 55% 1.8V/2.5V/3.3V Medical 4-Pin SMD T/R; Manufacturer: Epson; Max Supply Current: 2.2mA; Min Supply Voltage: 1.6V; Max Supply Voltage: 3.6V; Supplier 1: Digikey; Manufacturer Part Number: SG-210STF 25.0000ML3; RoHS: Yes; Category: Oscillators; Stock 1: 22617; Pricing 1: 1=1.62, 10=1.58, 50=1.5052, 100=1.325 (USD); Mount: Surface Mount; Case/Package: SMD/SMT; Min Operating Temperature: -40°C; Max Operating Temperature: 85°C; Frequency: 25MHz; Frequency Stability: 50ppm; Load Capacitance: 15pF; Package Quantity: 250; Packaging: Tape and Reel; Termination: SMD/SMT; Current Rating: 2.2mA; Max Duty Cycle: 55%; Series: SG-210STF; Length: 0.098inch; Width: 2mm; Height: 0.035inch; RoHS Compliant: Yes; Lead Free: Lead Free; ComponentLink1URL: https://datasheet.ciiva.com/29629/029-sg-210stf-e147-29629803.pdf?src-supplier=Digikey; ComponentLink1Description: https://datasheet.ciiva.com/29629/029-sg-210stf-e147-29629803.pdf?src-supplier=Digikey; ComponentLink2URL: https://datasheet.ciiva.com/29629/029-sg-210stf-e147-29629804.pdf?src-supplier=Digikey; ComponentLink2Description: https://datasheet.ciiva.com/29629/029-sg-210stf-e147-29629804.pdf?src-supplier=Digikey; ComponentLink3URL: https://datasheet.ciiva.com/29629/029-sg-210stf-e147-29629805.pdf?src-supplier=Digikey; ComponentLink3Description: https://datasheet.ciiva.com/29629/029-sg-210stf-e147-29629805.pdf?src-supplier=Digikey; Supplier Part Number 1: SER3807CT-ND